# EAGLE design PowerTest (EAGLE 9.5.2)
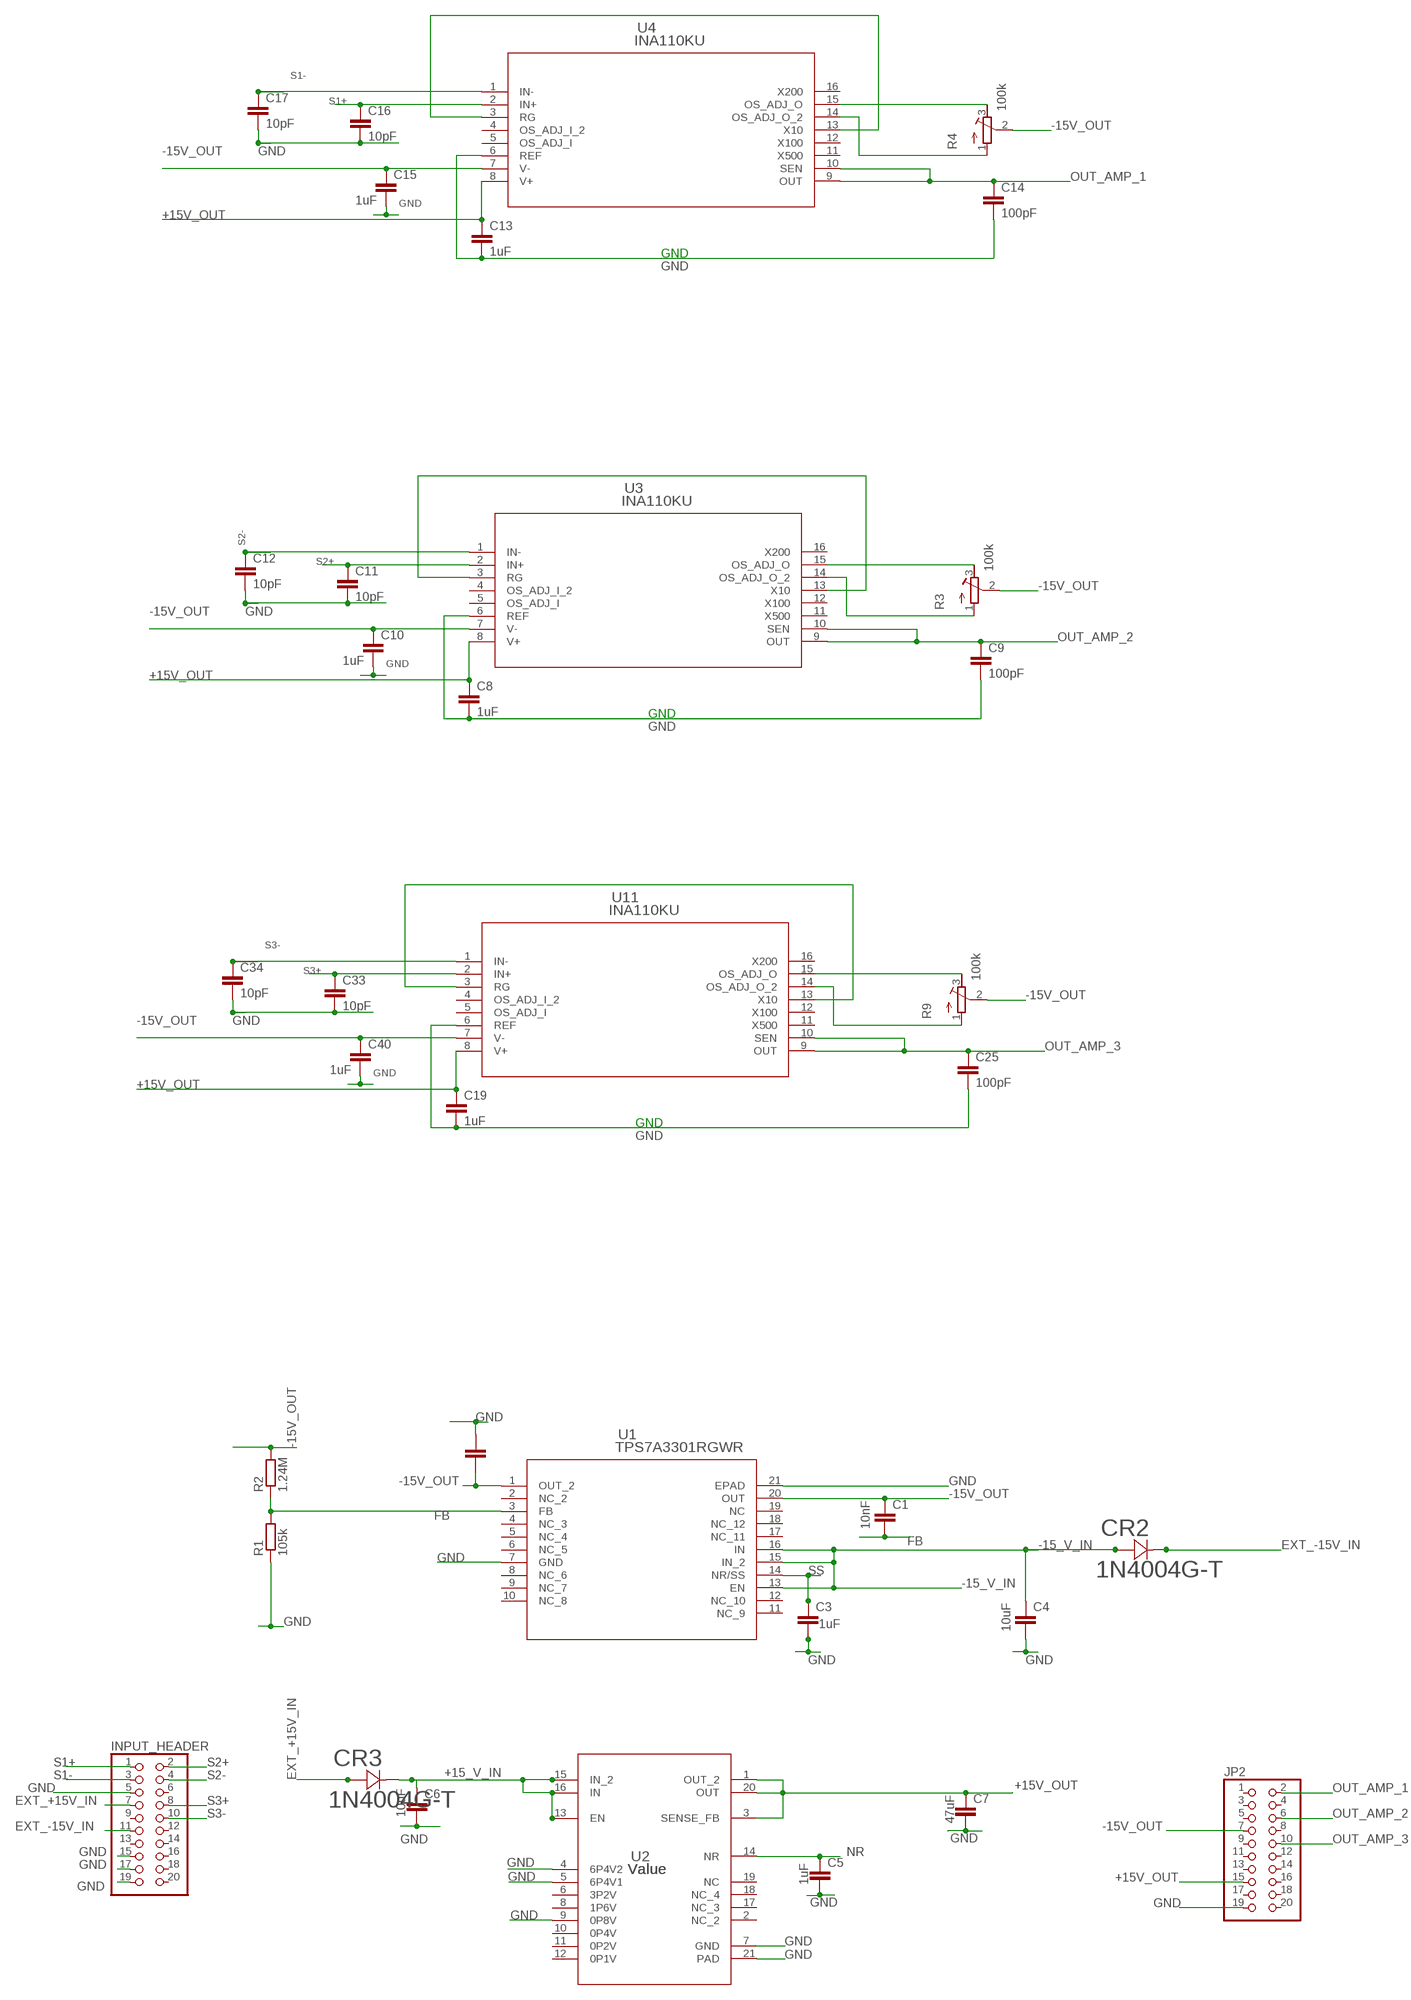
[diagram p0: schematic, sheet 1]

## Parts
C1  10nF  C-EUC1210  [C1210]
C3  1uF  C-EUC1210  [C1210]
C4  10uF  C-EUC1210  [C1210]
C5  1uF  C-EUC1210  [C1210]
C6  10uF  C-EUC1210  [C1210]
C7  47uF  C-EUC1210  [C1210]
C8  1uF  C-EUC1210  [C1210]
C9  100pF  C-EUC1210  [C1210]
C10  1uF  C-EUC1210  [C1210]
C11  10pF  C-EUC1210  [C1210]
C12  10pF  C-EUC1210  [C1210]
C13  1uF  C-EUC1210  [C1210]
C14  100pF  C-EUC1210  [C1210]
C15  1uF  C-EUC1210  [C1210]
C16  10pF  C-EUC1210  [C1210]
C17  10pF  C-EUC1210  [C1210]
C19  1uF  C-EUC1210  [C1210]
C25  100pF  C-EUC1210  [C1210]
C33  10pF  C-EUC1210  [C1210]
C34  10pF  C-EUC1210  [C1210]
C40  1uF  C-EUC1210  [C1210]
C55  47uF  C-EUC1210  [C1210]
CR2  1N4004G-T  [DO-41]
CR3  1N4004G-T  [DO-41]
INPUT_HEADER  PINHD-2X10  [2X10]
JP2  PINHD-2X10  [2X10]
R1  105k  R_CHIP-0805(2012-METRIC)  [RESC2012X65]
R2  1.24M  R_CHIP-0805(2012-METRIC)  [RESC2012X65]
R3  100k  R-TRIMM3296Y  [RTRIM3296Y]
R4  100k  R-TRIMM3296Y  [RTRIM3296Y]
R9  100k  R-TRIMM3296Y  [RTRIM3296Y]
U1  TPS7A3301RGWR  [RGW0020A]
U2  Value  TPS7A4700RGWR  [RGW0020A]
U3  INA110KU  [SO-G16G6.9]
U4  INA110KU  [SO-G16G6.9]
U11  INA110KU  [SO-G16G6.9]

## Nets
+15_V_IN: C6.1 CR3.1 U2.13(EN) U2.15(IN_2) U2.16(IN)
+15V_OUT: C7.1 C8.1 C13.1 C19.1 JP2.15 U2.1(OUT_2) U2.3(SENSE_FB) U2.20(OUT) U3.8(V+) U4.8(V+) U11.8(V+)
-15_V_IN: C4.1 CR2.2 U1.13(EN) U1.15(IN_2) U1.16(IN)
-15V_OUT: C1.1 C10.1 C15.1 C40.1 C55.2 JP2.7 R2.2 R3.2(S) R4.2(S) R9.2(S) U1.1(OUT_2) U1.20(OUT) U3.7(V-) U4.7(V-) U11.7(V-)
EXT_+15V_IN: CR3.2 INPUT_HEADER.7
EXT_-15V_IN: CR2.1 INPUT_HEADER.11
FB: C1.2 R1.2 R2.1 U1.3(FB)
GND: C3.2 C4.2 C5.2 C6.2 C7.2 C8.2 C9.2 C10.2 C11.2 C12.2 C13.2 C14.2 C15.2 C16.2 C17.2 C19.2 C25.2 C33.2 C34.2 C40.2 C55.1 INPUT_HEADER.5 INPUT_HEADER.15 INPUT_HEADER.17 INPUT_HEADER.19 JP2.19 R1.1 U1.7(GND) U1.21(EPAD) U2.4(6P4V2) U2.5(6P4V1) U2.7(GND) U2.9(0P8V) U2.21(PAD) U3.6(REF) U4.6(REF) U11.6(REF)
N$3: U3.3(RG) U3.13(X10)
N$4: U11.3(RG) U11.13(X10)
N$5: R3.3(E) U3.15(OS_ADJ_O)
N$6: R3.1(A) U3.14(OS_ADJ_O_2)
N$8: U4.3(RG) U4.13(X10)
N$9: R4.3(E) U4.15(OS_ADJ_O)
N$10: R4.1(A) U4.14(OS_ADJ_O_2)
N$14: R9.3(E) U11.15(OS_ADJ_O)
N$15: R9.1(A) U11.14(OS_ADJ_O_2)
NR: C5.1 U2.14(NR)
OUT_AMP_1: C14.1 JP2.2 U4.9(OUT) U4.10(SEN)
OUT_AMP_2: C9.1 JP2.6 U3.9(OUT) U3.10(SEN)
OUT_AMP_3: C25.1 JP2.10 U11.9(OUT) U11.10(SEN)
S1+: C16.1 INPUT_HEADER.1 U4.2(IN+)
S1-: C17.1 INPUT_HEADER.3 U4.1(IN-)
S2+: C11.1 INPUT_HEADER.2 U3.2(IN+)
S2-: C12.1 INPUT_HEADER.4 U3.1(IN-)
S3+: C33.1 INPUT_HEADER.8 U11.2(IN+)
S3-: C34.1 INPUT_HEADER.10 U11.1(IN-)
SS: C3.1 U1.14(NR/SS)
Unconnected: INPUT_HEADER.6 INPUT_HEADER.9 INPUT_HEADER.12 INPUT_HEADER.13 INPUT_HEADER.14 INPUT_HEADER.16 INPUT_HEADER.18 INPUT_HEADER.20 JP2.1 JP2.3 JP2.4 JP2.5 JP2.8 JP2.9 JP2.11 JP2.12 JP2.13 JP2.14 JP2.16 JP2.17 JP2.18 JP2.20 U1.2(NC_2) U1.4(NC_3) U1.5(NC_4) U1.6(NC_5) U1.8(NC_6) U1.9(NC_7) U1.10(NC_8) U1.11(NC_9) U1.12(NC_10) U1.17(NC_11) U1.18(NC_12) U1.19(NC) U2.2(NC_2) U2.6(3P2V) U2.8(1P6V) U2.10(0P4V) U2.11(0P2V) U2.12(0P1V) U2.17(NC_3) U2.18(NC_4) U2.19(NC) U3.4(OS_ADJ_I_2) U3.5(OS_ADJ_I) U3.11(X500) U3.12(X100) U3.16(X200) U4.4(OS_ADJ_I_2) U4.5(OS_ADJ_I) U4.11(X500) U4.12(X100) U4.16(X200) U11.4(OS_ADJ_I_2) U11.5(OS_ADJ_I) U11.11(X500) U11.12(X100) U11.16(X200)

## Notes on the sheet
- GND
- GND
- GND

## Library data of the parts
C1 C3-C17 C19 C25 C33 C34 C40 C55 = rcl:C-EU: CAPACITOR, European symbol; SPICEPREFIX: C
CR2 CR3 = 1N4004GT:1N4004G-T; MANUFACTURER_PART_NUMBER: 1N4004GT; VENDOR: Diodes Inc
INPUT_HEADER JP2 = Connector:PINHD-2X10: PIN HEADER; CATEGORY: CONNECTOR; SUB-CATEGORY: PIN-HEADER
R1 R2 = Resistor:R: Resistor Fixed - Generic; CATEGORY: Resistor; SUB-CATEGORY: Fixed
R3 R4 R9 = rcl:R-TRIMM: Trimm resistor; SPICEMODEL: X; SPICEPREFIXL: POT
U1 = TPS7A3301:TPS7A3301RGWR; DATASHEET_URL: http://www.ti.com/lit/gpn/TPS7A3301; DESCRIPTION: Vin -3V to -36V, -1A, Ultra-Low Noise, High PSRR, Low-Dropout Linear Regulator; FAMILY_NAME: SINGLE CHANNEL LDO; GENERIC_PART_NUMBER: TPS7A3301; INDUSTRY_STD_PKG_TYPE: VQFN; MANUFACTURER: Texas Instruments; MANUFACTURER_PART_NUMBER: TPS7A3301RGWR; PACKAGE_DESIGNATOR: RGW; PIN_COUNT: 20; VENDOR: Texas Instruments
U2 = TPS7A4700:TPS7A4700RGWR; MANUFACTURER: Texas Instruments; PARTNUMBER: TPS7A4701RGWR; REFDES: RefDes; TYPE: TYPE
U3 U4 U11 = INA110KU:INA110KU; MANUFACTURER_PART_NUMBER: INA110KU; VENDOR: Texas Instruments

## Board
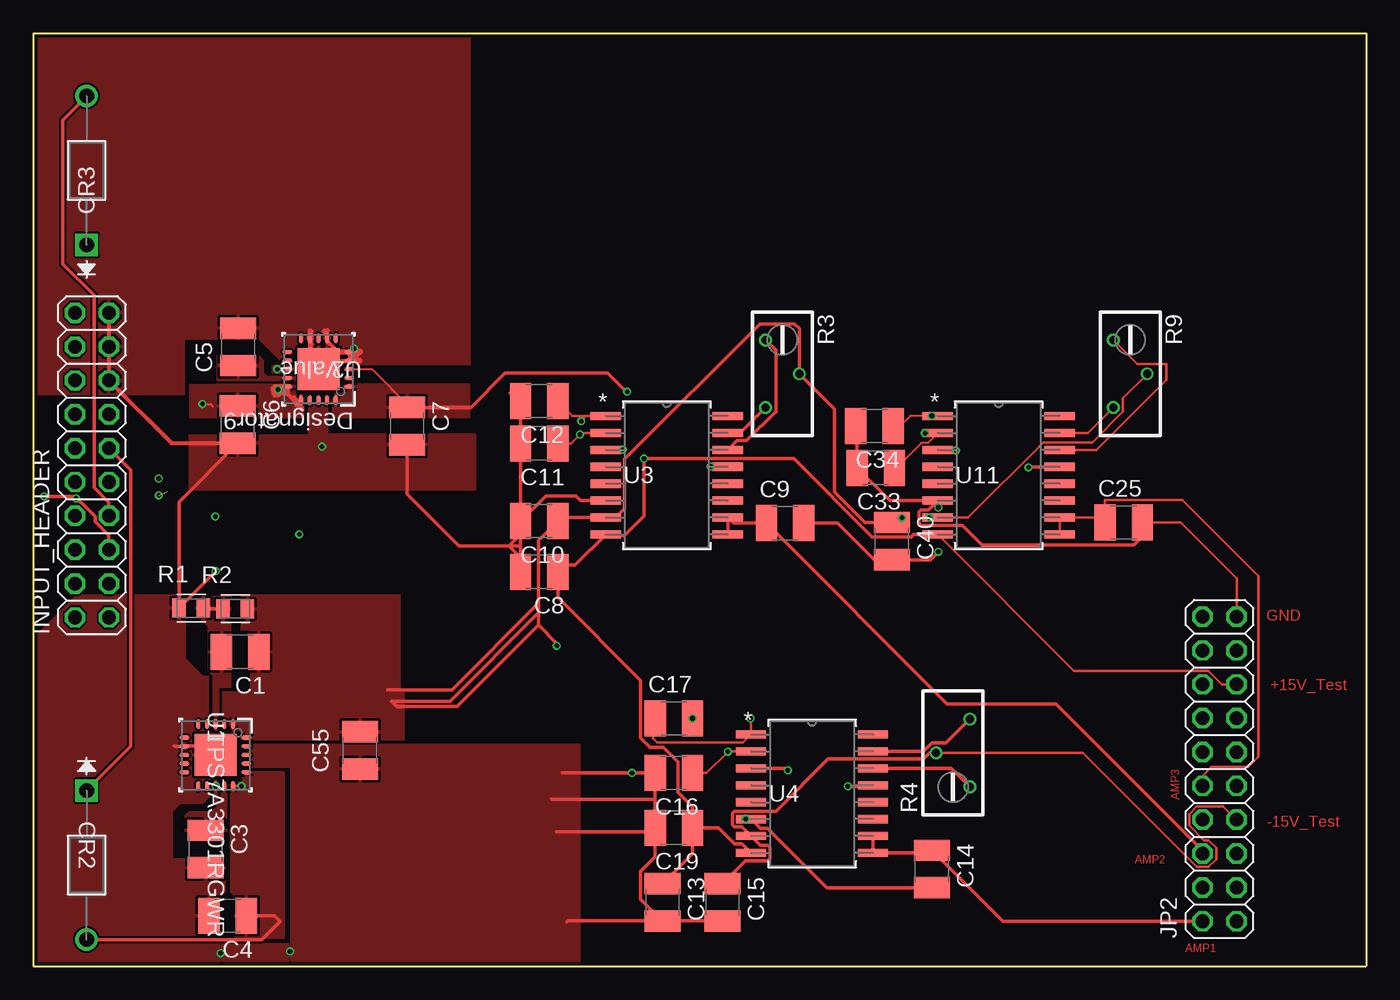
[diagram p1: board, top side]
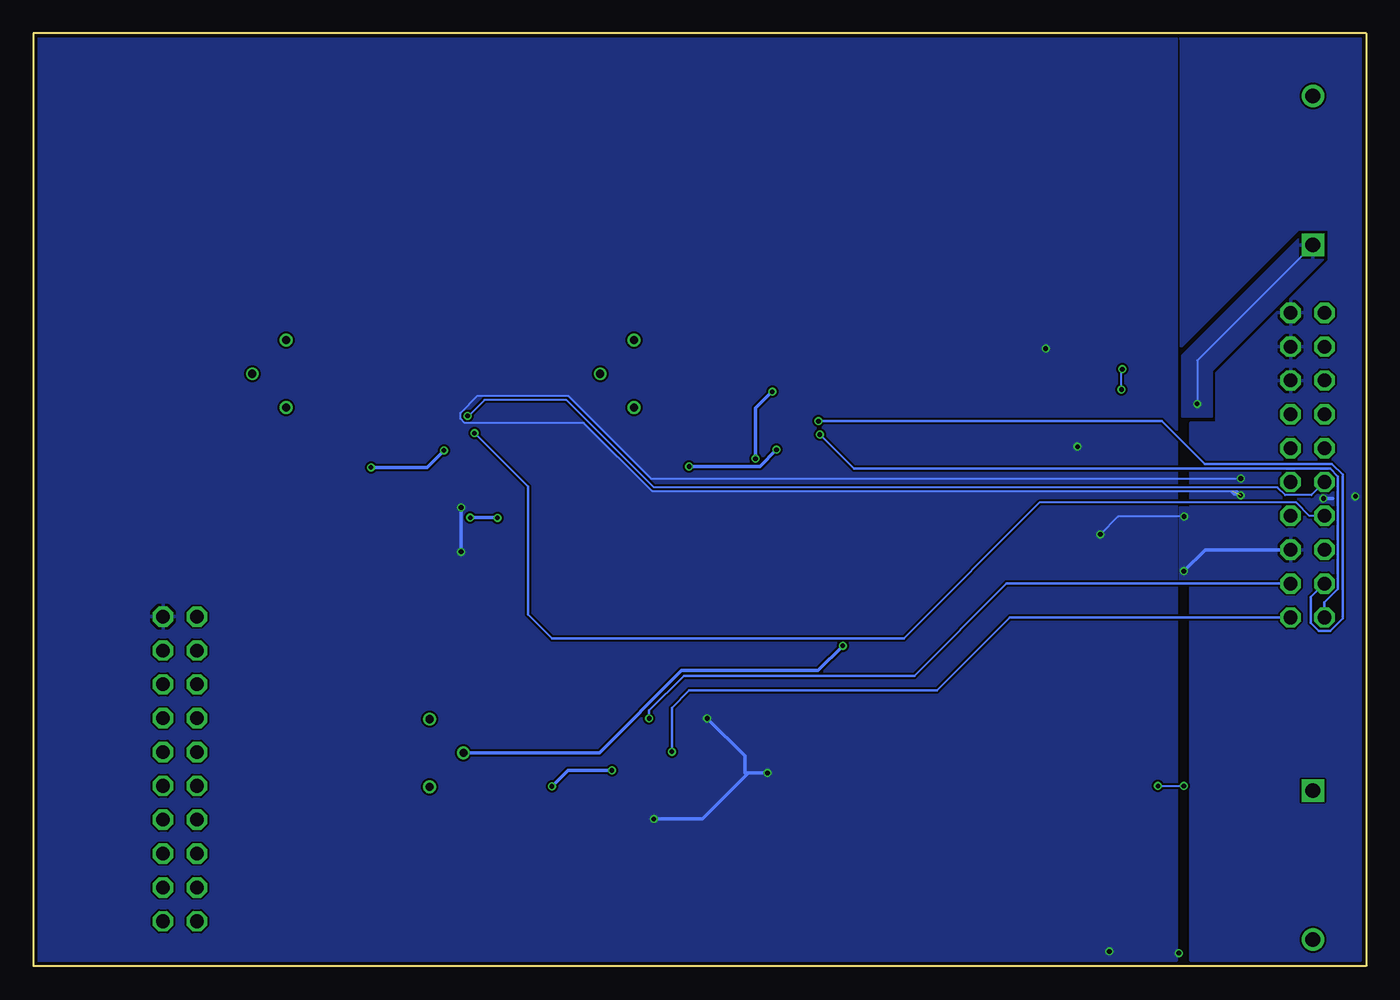
[diagram p2: board, bottom side, seen from below]

Size 100 x 70 mm. Coordinates in mm from the lower left corner, seen from the top.
Outline: 0,0 100,0 100,70 0,70 0,0
Copper layers (1*16): Top 0.018mm / dielectric 1.55mm / Bottom 0.018mm
Design rules "eC_2Layer_PClass6_BaseCopperO18_eCDefault": minimum track width 0.15mm, minimum drill 0.35mm, track to track 0.15mm, track to pad 0.15mm, pad to pad 0.15mm, via to via 0.15mm, smd to smd 0mil, copper to edge 0.25mm, drill to drill 0.35mm, minimum pad ring 0.175mm, minimum via ring 0.125mm, stop-mask expansion 0mil, vias tented up to drill 0.45mm, thermal gap 0.2mm

### Footprints (pad centres in the part's own frame; a part is rotated, then mirrored left to right if it is on the bottom)
C1210 = smd 1.6 x 2.7: 1 -1.4,0; 2 1.4,0
DO-41 = drill 1.118 pad 1.626 square: 1 -11.176,0 | drill 1.118 pad 1.626: 2 0,0
2X10 = drill 1.016 octagon: 1 -11.43,-1.27; 2 -11.43,1.27; 3 -8.89,-1.27; 4 -8.89,1.27; 5 -6.35,-1.27; 6 -6.35,1.27; 7 -3.81,-1.27; 8 -3.81,1.27; 9 -1.27,-1.27; 10 -1.27,1.27; 11 1.27,-1.27; 12 1.27,1.27; 13 3.81,-1.27; 14 3.81,1.27; 15 6.35,-1.27; 16 6.35,1.27; 17 8.89,-1.27; 18 8.89,1.27; 19 11.43,-1.27; 20 11.43,1.27
RESC2012X65 = smd 1.031 x 1.42: 1 -0.919,0; 2 0.919,0
RTRIM3296Y = drill 0.61: 1 1.27,-2.54; 2 -1.27,0; 3 1.27,2.54
RGW0020A = smd 0.75 x 0.3: 1 -2.325,1.3; 2 -2.325,0.65; 3 -2.325,0; 4 -2.325,-0.65; 5 -2.325,-1.3; 11 2.325,-1.3; 12 2.325,-0.65; 13 2.325,0; 14 2.325,0.65; 15 2.325,1.3 | smd 0.3 x 0.75: 6 -1.3,-2.325; 7 -0.65,-2.325; 8 0,-2.325; 9 0.65,-2.325; 10 1.3,-2.325; 16 1.3,2.325; 17 0.65,2.325; 18 0,2.325; 19 -0.65,2.325; 20 -1.3,2.325 | smd 3.15 x 3.15: 21 0,0 | smd 0.5 x 0.5: V 0,1.325
SO-G16G6.9 = smd 2.261 x 0.61: 1 -9.149,8.89; 2 -9.149,7.62; 3 -9.149,6.35; 4 -9.149,5.08; 5 -9.149,3.81; 6 -9.149,2.54; 7 -9.149,1.27; 8 -9.149,0; 9 0,0; 10 0,1.27; 11 0,2.54; 12 0,3.81; 13 0,5.08; 14 0,6.35; 15 0,7.62; 16 0,8.89

### Placement (x,y rotation side)
C1  15.52,23.6 180 top
C3  12.93,8.79 270 top
C4  14.58,3.78 180 top
C5  15.36,46.47 90 top
C6  15.34,40.64 270 top
C7  28.04,40.53 270 top
C8  37.95,29.6 180 top
C9  56.4,33.24 0 top
C10  37.95,33.4 180 top
C11  37.95,39.23 180 top
C12  37.95,42.4 180 top
C13  47.2,4.8 270 top
C14  67.4,7.3 270 top
C15  51.7,4.8 270 top
C16  48.05,14.5 180 top
C17  48.05,18.6 0 top
C19  48.05,10.4 180 top
C25  81.8,33.3 0 top
C33  63.2,37.4 180 top
C34  63.1,40.53 180 top
C40  64.4,31.9 270 top
C55  24.5,16.2 90 top
CR2  4,2 270 top
CR3  4,65.3 90 top
INPUT_HEADER  4.4,37.6 90 top
JP2  89,14.8 90 top
R1  11.85,26.87 0 top
R2  15.15,26.82 0 top
R3  56.2,44.45 180 top
R4  69,16 0 top
R9  82.3,44.45 180 top
U1  13.68,15.85 270 top
U2  21.39,44.79 180 top
U3  52.1,32.39 0 top
U4  63,8.5 0 top
U11  77,32.39 0 top

### Tracks (layer width: path | path; a pad name or v marks a point on that pad's centre or on a via)
+15_V_IN  (via drill 0.35)
  Top 0.15: v18.3,44.8 v18.31,44.79 U2.13
  Top 0.152: v12.68,42.19 13.31,42.19 13.47,42.03
  Top 0.305: 19.33,42.67 19.58,42.67 19.95,42.3 19.73,42.07 19.73,42.1 19.83,42.21 20.17,41.87 20.17,41.76 20.09,41.84 U2.16 19.54,42.47 19.33,42.67 | 18.08,42.83 18.41,42.83 18.59,43.02 | 18.08,42.83 18.27,43.02 | 18.27,43.02 18.52,43.27 v18.36,43.27 | 19,43.42 U2.15 19.07,42.94 | 19,43.42 18.59,43.02 | 19.07,42.94 19.33,42.67 | 18.59,43.02 18.98,43.02 19.07,42.94 | 18,43.3 18.05,43.24 18.27,43.02 | v18.36,43.27 18.08,42.99 18.08,42.83 | v18.36,43.27 18.51,43.42 19,43.42
  Top 0.406: 18.05,43.24 18.08,43.21 18.08,42.99 | v18.36,43.27 18.02,43.27 18,43.3 18.19,43.49 U2.15
  Bottom 0.15: v18.36,43.27 18.36,44.8 v18.3,44.8
  Bottom 0.152: CR3.1 12.68,45.44 v12.68,42.19
  pour Top: 20.29,42.87 20.29,41.17 11.74,41.17 11.74,43.64 19.63,43.64 19.63,42.9 19.65,42.88 20.28,42.88
  pour Top: 19.5,45.01 19.5,44.57 19.45,44.52 17.92,44.52 17.92,45.08 19.48,45.08 19.52,45.04
  pour Bottom: 4.8,54.85 3.22,54.85 3.22,53.02 11.57,44.67 11.57,41.21 11.59,41.19 13.76,41.19 13.78,41.21 13.78,45.86 4.8,54.84
+15V_OUT  (via drill 0.35)
  Top 0.15: U2.3 25.42,44.79 28.28,41.93
  Top 0.2: U11.8 78.08,22.16 88.15,22.16 89.16,21.15 JP2.15
  Top 0.254: U4.8 53.16,9.19 52.61,9.19 51.39,10.4 C19.1 | C19.1 49.45,8.45 C13.1 | C19.1 49.45,11.96 48.37,13.04 48.37,15.32 47.27,16.42 46.28,16.42 45.57,17.14 45.57,21.43 39.35,27.66 C8.1 39.1,29.85 39.1,30.1 40.66,30.1 U3.8 43.01,32.33 44.35,32.33 45.82,33.8 v45.82,38.08 57.05,38.08 62.91,32.22 65.86,32.22 66.03,32.39 U11.8 | C7.1 28.28,41.93 32.83,41.93 35.41,44.51 43.08,44.51 44.48,43.11 v44.56,43.11
  Bottom 0.254: v44.56,43.11 44.59,43.11 45.82,41.88 v45.82,38.08
  pour Top: 32.74,43.67 23.29,43.67 23.28,43.66 23.28,42.92 22.44,42.92 22.44,41.18 32.74,41.18
-15_V_IN  (via drill 0.35)
  Top 0.15: U1.15 15.55,13.53 15.56,13.52 v15.62,13.52
  Top 0.254: CR2.2 17.14,2 18.52,3.38 18.12,3.78 C4.1
  Bottom 0.15: v15.62,13.52 U1.13 v13.68,13.53
  pour Top: 14.8,13.8 14.8,5.6 15.1,5.3 15.1,2.1 18.8,2.1 18.8,14.5 18.8,14.6 15.7,14.6 15.7,13.8
  pour Top: 13.8,13.9 13.5,13.9 13.5,12.4 13.8,12.4
-15V_OUT  (via drill 0.35)
  Top 0.2: R9.2 81.76,42.64 81.76,41.61 79.45,39.3 75.77,39.3 70.13,33.66 U11.7 | R4.2 78.75,16 87.31,7.44 88.15,7.44 88.74,8.03 88.74,8.87 88.15,9.46 87.83,9.46 86.72,10.57 86.72,11.41 87.31,12 89.26,12 JP2.7
  Top 0.254: R4.2 67.23,16 66.77,15.54 59.62,15.54 55.7,11.62 52.61,11.62 52.44,11.46 52.44,10.62 52.61,10.46 53.16,10.46 U4.7 54.54,9.08 55.1,9.08 55.26,8.92 55.26,8.08 55.1,7.92 53.42,7.92 C15.1 | U11.7 v67.22,33.66 | v65.18,33.64 64.84,33.3 C40.1 62.4,33.3 60.1,35.6 60.1,41.82 R3.2 57.47,47.83 57.1,48.2 54.5,48.2 44.36,38.06 44.36,34.36 43.6,33.6 43.01,33.6 U3.7 39.61,33.66 C10.1 37.91,31.96 37.91,27.25 | 37.91,27.25 31.4,20.74 26.59,20.74 | 37.91,27.25 37.91,26.54 | 37.91,26.54 37.91,25.61 | 37.91,25.61 31.79,19.49 27.27,19.49 26.88,19.88 31.25,19.88 37.91,26.54 | 37.91,25.61 37.91,25.59 39.27,24.23 v39.27,24.05
  Bottom 0.254: v67.22,33.66 65.22,33.66 65.21,33.67 v65.18,33.64 | v39.27,24.05 41.14,22.18 51.36,22.18 57.53,16 R4.2
  pour Top: 15.7,17 27.8,17 27.8,20.5 27.7,20.6 14.2,20.6 14.2,17.7 15.6,17.7 15.6,17
  pour Top: 16.3,20.6 16.3,25.2 15.6,25.2 15.6,27.9 27.5,27.9 27.5,20.6
EXT_+15V_IN
  Top 0.254: INPUT_HEADER.7 5.67,34.8 4.56,35.91 4.56,50.34 2.2,52.7 2.2,63.5 CR3.2
EXT_-15V_IN
  Top 0.254: INPUT_HEADER.11 7.3,37.24 7.3,34.8 7.3,16.48 CR2.1
FB
  Top 0.254: R2.1 12.82,26.82 R1.2
  pour Top: 13.5,17.7 13.5,21.8 13.1,22.2 13.1,25.5 12.6,26 12.2,26 12.2,27.8 14.8,27.8 14.8,20.9 14,20.9 13.9,20.9 13.9,18.4 13.9,18.2 13.9,17.7
GND  (via drill 0.35)  (1 unrouted)
  Top 0.15: C8.2 36.55,29.15 | U2.9 20.78,47.16 | U2.21 20.8,45.38 20.8,46
  Top 0.2: C25.2 83.42,33.3 86.1,33.3 90.3,29.1 90.3,26.26 JP2.19
  Top 0.254: C14.2 59.55,5.9 55.1,10.35 54.54,10.35 U4.6 v53.44,11.04 | U11.6 64.27,34.93 C33.2 61.8,40.43 C34.2 | C15.2 C13.2 | C19.2 46.65,8.19 45.57,7.12 45.57,5.03 C13.2 | 36.55,29.15 36.6,29.1 | U3.6 41.07,34.93 40.7,35.3 38.45,35.3 C10.2 | C10.2 C11.2 36.55,42.2 | 36.55,42.2 C12.2 | 35.76,42.99 36.55,42.2 | v67.9,31.1 67.3,30.5 C40.2 64.13,30.23 63.35,30.23 60.34,33.24 C9.2 | v67.9,34.42 67.85,34.47 U11.6 | U11.6 67.16,34.24 66.61,34.24 66.44,34.08 66.44,33.24 66.61,33.08 69.7,33.08 71.17,31.61 82.57,31.61 83.42,32.46 83.42,33.3 | U1.21 12.99,15.85 12.31,16.53 11.38,16.53 U1.7 10.61,16.5 10.56,16.55 | C13.2 40.12,3.4 40.06,3.34 | 46.65,12.51 C16.2 v44.92,14.5 39.68,14.5 39.66,14.52 | 46.65,12.51 C19.2 | C19.2 46.33,10.08 39.26,10.08 | 46.65,12.51 38.92,12.51 38.89,12.54 | C10.2 36.55,32.37 | 36.55,32.37 36.55,31.55 | 36.55,31.55 36.55,30.68 | 36.55,30.68 C8.2 | 36.55,31.55 35.68,31.55 | 35.68,31.55 31.93,31.55 28.04,35.44 C7.2 | 35.68,31.55 36.5,32.37 36.55,32.37 | 35.68,31.55 36.55,30.68 | C6.2 10.93,34.83 R1.1 13.68,29.62 v13.68,29.64 | v0.81,35.26 3.04,35.26 v3.21,35.09 3.47,34.83 3.56,34.83 4.63,33.76 4.63,33.36 5.67,32.32 INPUT_HEADER.5 | U2.7 22.04,47.65 | U2.21 22,45.4 22.7,45.4
  Top 0.305: INPUT_HEADER.19 INPUT_HEADER.15 10.38,39.24 C6.2 | 22.7,45.4 23.68,45.4 U2.4 U2.5 22.85,46.09 22.04,46.9 22.04,47.02 | 20.8,46 20.8,46.23
  Top 0.406: 22.04,47.65 22.02,47.67 21.85,47.67 | 20.8,46.23 20.8,47.63 20.78,47.65 20.78,47.16 | 24.1,45.44 U2.4 23.73,45.43 24.48,45.43 24.47,45.44 24.1,45.44 | 24.06,46.11 24.53,46.11 24.51,46.09 24.24,46.09 | 24.06,46.11 23.73,46.11 U2.5 | U2.5 24.24,46.09 | U2.5 24.1,45.7 | 24.1,45.7 24.1,45.44 | 24.1,45.7 24.24,45.84 24.24,46.09 | 24.06,46.11 24.04,46.09 22.85,46.09
  Bottom 0.15: v13.66,33.74 18.62,33.74 v19.95,32.41 | 10.05,35.63 53.55,35.63 58.7,40.77 67.64,40.77 67.94,41.08 67.94,41.52 66.66,42.8 59.88,42.8 53.66,36.59 v9.41,36.59
  Bottom 0.254: v67.9,31.1 v67.9,34.42 | C17.2 46.62,15.77 46.62,14.5 46.33,14.5 | 46.33,14.5 v44.92,14.5 | 46.33,14.5 49.78,11.05 v53.44,11.05 v53.44,11.04 | v3.21,35.09 2.5,35.09 | INPUT_HEADER.5 12.07,31.25 v13.68,29.64 | 9.89,35.42 10.05,35.58 9.67,35.58 v9.42,35.33 9.51,35.42 9.89,35.42
  other vias: 24.05,46.35 49.45,18.6 14.06,0.98 19.27,1.11 21.66,38.98
  pour Top: 13.2,14.2 13.2,12.7 12.7,12.2 11,12.2 10.4,11.6 10.4,8.1 14.4,8.1 14.4,5.6 13.99,5.19 13.99,0.2 0.1,0.2 0.1,24.7 3.3,27.9 11.4,27.9 11.4,23.1 12.7,21.8 13.1,21.8 13.1,17.4 15.3,17.4 15.3,16.7 41,16.7 41,0.2 19.5,0.2 19.3,0.4 19.3,14.9 15.2,14.9 15.2,14.3 13.1,14.3
  pour Top: 20.67,43.29 20.67,39.87 20.68,39.86 11.71,39.86 11.7,39.87 11.7,35.77 11.68,35.75 33.15,35.75 33.18,35.72 33.18,39.95 22.08,39.95 22.07,39.96 22.07,43.8 20.68,43.8 20.67,43.79
  pour Top: 21.59,45.17 32.69,45.17 32.77,45.09 32.77,69.65 32.81,69.69 0.28,69.69 0.25,69.66 0.25,42.92 11.32,42.92 11.32,47.1 16.89,47.1 18.58,45.41 19.54,45.41 19.67,45.28 21.1,45.28 21.25,45.13 21.61,45.13 21.62,45.14
  pour Top: 14.14,0.36 19.16,0.36 19.17,0.37 19.16,0.38 19.16,1.7 14.14,1.7
  pour Bottom: 8.63,69.58 0.43,69.58 0.43,0.46 0.47,0.42 0.48,0.43 13.14,0.43 13.14,40.77 11.32,40.77 11.21,40.88 11.21,44.51 2.76,52.96 2.76,55.3 5.1,55.3 13.86,46.54 13.86,69.51 13.94,69.59 8.65,69.59
  pour Bottom: 14.24,69.54 14.24,0.47 14.23,0.46 99.68,0.46 99.68,69.6 99.69,69.61 14.25,69.61 14.23,69.59
  pour Bottom: 13.34,34.47 13.34,29 13.35,28.99 14.05,28.99 14.03,29.01 14.03,34.45 13.36,34.45 13.35,34.46
N$3  (via drill 0.35)
  Top 0.254: U3.3 44.26,38.74 v44.24,38.76 | v50.8,37.5 52.07,37.5 U3.13
  Bottom 0.254: v44.24,38.76 45.5,37.5 v50.8,37.5
N$4  (via drill 0.35)
  Top 0.254: U11.13 74.72,37.47 v74.67,37.43 | v69.2,38.7 67.89,38.7 U11.3
  Bottom 0.254: v74.67,37.43 70.47,37.43 v69.2,38.7
N$5
  Top 0.254: R3.3 53.03,40.01 U3.15
N$6
  Top 0.254: U3.14 52.79,39.43 53.52,39.43 55.69,41.6 55.7,41.6 55.7,46.22 R3.1
N$8  (via drill 0.35)
  Top 0.254: U4.3 56.55,14.85 56.6,14.8 v56.6,14.7 | v61.1,13.5 62.92,13.5 U4.13
  Bottom 0.254: v56.6,14.7 59.9,14.7 v61.1,13.5
N$9
  Top 0.254: U4.15 66.78,16.12 67.42,16.76 68.49,16.76 R4.3
N$10
  Top 0.254: R4.1 68.88,14.85 U4.14
N$14
  Top 0.2: R9.3 79.13,40.01 U11.15
N$15
  Top 0.2: R9.1 82.82,45.2 85,45.2 85,44 79.74,38.74 U11.14
NR
  pour Top: 19.63,44.26 19.63,43.92 13.82,43.92 13.81,43.93 13.81,45.82 16.93,45.82 17.25,45.5 17.25,44.56 17.53,44.28 19.62,44.28 19.63,44.27
OUT_AMP_1
  Top 0.254: C14.1 67.52,8.58 | 67.52,8.58 72.73,3.37 JP2.2 | U4.10 U4.9 67.44,8.5 67.52,8.58
OUT_AMP_2
  Top 0.254: U3.9 U3.10 52.52,33.24 C9.1 68.54,19.7 76.7,19.7 87.73,8.67 JP2.6
OUT_AMP_3
  Top 0.2: U11.9 U11.10 80.04,33.66 C25.1 80.4,35 86.2,35 91.9,29.3 91.9,15.7 91.14,14.94 88.4,14.94 87.68,14.22 87.68,13.58
  Top 0.254: JP2.10 87.68,13.58
S1+  (via drill 0.35)
  Top 0.2: U4.2 52.12,16.12 v52.1,16.1 50.5,14.5 C16.1
  Bottom 0.2: INPUT_HEADER.1 26.73,26.17 32.2,20.7 50.8,20.7 52.1,19.4 v52.1,16.1
S1-  (via drill 0.35)
  Top 0.2: C17.1 46.5,18.45 46.5,17.1 46.8,16.8 53.26,16.8 U4.1 53.85,18.55 v53.8,18.6
  Bottom 0.2: INPUT_HEADER.3 26.99,28.71 33.9,21.8 51.2,21.8 53.8,19.2 v53.8,18.6
S2+  (via drill 0.35)
  Top 0.2: U3.2 41.11,40.01 v41,39.9 40.33,39.23 C11.1
  Bottom 0.2: INPUT_HEADER.2 3.13,27.28 2.12,28.29 2.12,36.75 2.71,37.34 38.44,37.34 v41,39.9
S2-  (via drill 0.35)
  Top 0.2: v41.1,40.9 41.48,41.28 | 41.48,41.28 41.6,41.28 U3.1 | 41.48,41.28 40.47,41.28 C12.1
  Bottom 0.2: v41.1,40.9 15.32,40.9 12.11,37.69 2.57,37.69 1.77,36.89 1.77,26.1 2.71,25.16 3.55,25.16 4.14,25.75 4.14,27.7 INPUT_HEADER.4
S3+  (via drill 0.35)
  Top 0.152: U11.2 67.11,39.27 66.63,39.27 64.75,37.4 C33.1
  Top 0.254: v66.9,40 67.84,40 U11.2
  Bottom 0.152: INPUT_HEADER.8 4.27,33.79 5.26,34.78 24.52,34.78 34.7,24.6
  Bottom 0.2: 34.7,24.6 61.1,24.6 62.9,26.4 62.9,36 v66.9,40
S3-  (via drill 0.35)
  Top 0.152: C34.1 65.03,40.53 65.8,41.3 67.27,41.3 67.29,41.28 U11.1
  Top 0.254: U11.1 67.44,41.28 v67.42,41.3
  Bottom 0.152: INPUT_HEADER.10 4.12,35.34 6.08,35.34 6.67,35.93 53.43,35.93 60,42.5 66.16,42.5 67.36,41.3 v67.42,41.3
SS
  pour Top: 14.5,13.8 14.5,9.5 11.4,9.5 11.4,11.3 11.7,11.6 13.4,11.6 14.1,12.3 14.1,13.8

### Text on the board
Top: GND | +15V_Test | AMP3 | -15V_Test | AMP2 | AMP1